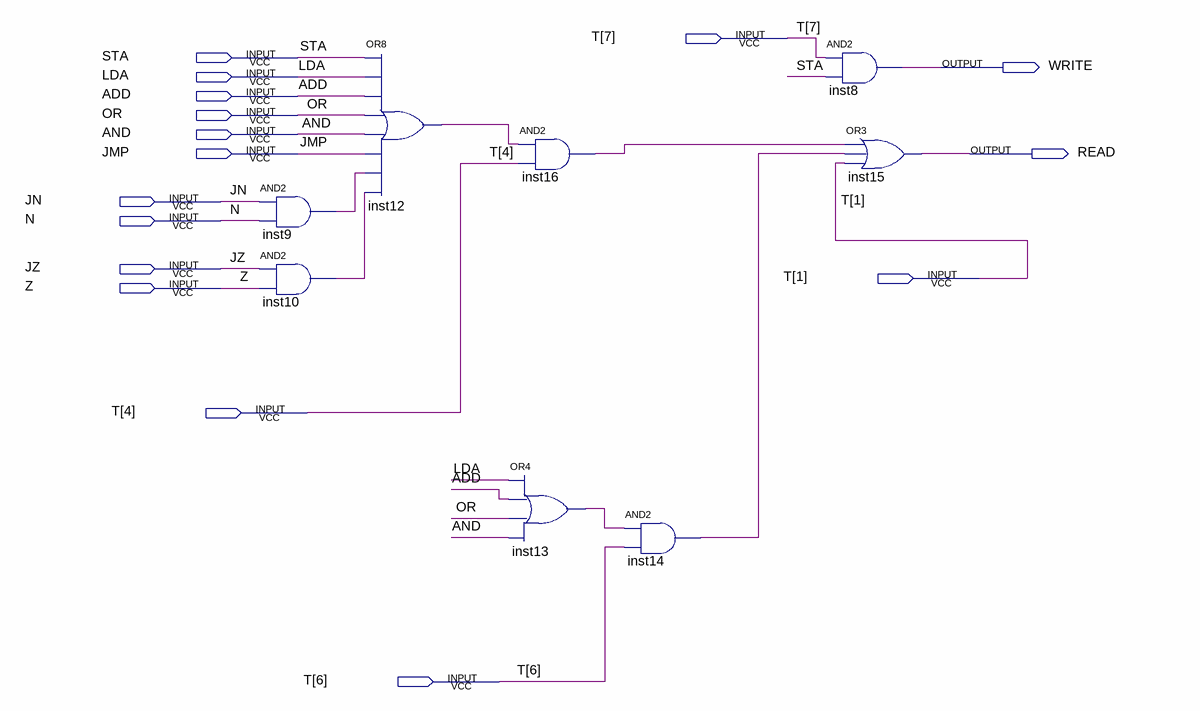
[diagram p0: schematic sheet]
// Quartus schematic UNIDADE_CONTROLE_READ_WRITE.bdf as structural Verilog: 8 symbols, 16 pins
module UNIDADE_CONTROLE_READ_WRITE (
  input  [7:1] T,
  input  STA,
  input  LDA,
  input  ADD,
  input  OR,
  input  AND,
  input  JMP,
  input  JN,
  input  N,
  input  JZ,
  input  Z,
  output WRITE,
  output READ
);

  wire inst9_out, inst10_out, inst12_out, inst13_out, inst14_out, inst16_out;

  and inst9 (inst9_out, JN, N);
  and inst10 (inst10_out, JZ, Z);
  or inst12 (inst12_out, STA, LDA, ADD, OR, AND, JMP, inst9_out, inst10_out);
  and inst16 (inst16_out, inst12_out, T[4]);
  or inst13 (inst13_out, LDA, ADD, OR, AND);
  and inst14 (inst14_out, inst13_out, T[6]);
  and inst8 (WRITE, T[7], STA);
  or inst15 (READ, inst16_out, inst14_out, T[1]);
endmodule
